# Altium schematic sheet 3_Power.schdoc.schdoc
size 309 x 223 mm; Symbol: Sheet-Symbol_A4; Device: Sheet-Symbol_A4; Company: EasyEDA.com; Drawed: EasyEDA Pro; Reviewed: EasyEDA Pro; Version: V0.1; Page Size: A4; @Project Name: AutoPilot; @Page Count: 2; @Update Date: 2023-12-01; @Create Date: 2023-10-27; @Schematic Name: Schematic1; Part Number: JLCPCB-002; @Page No: 1; @Page Name: Power
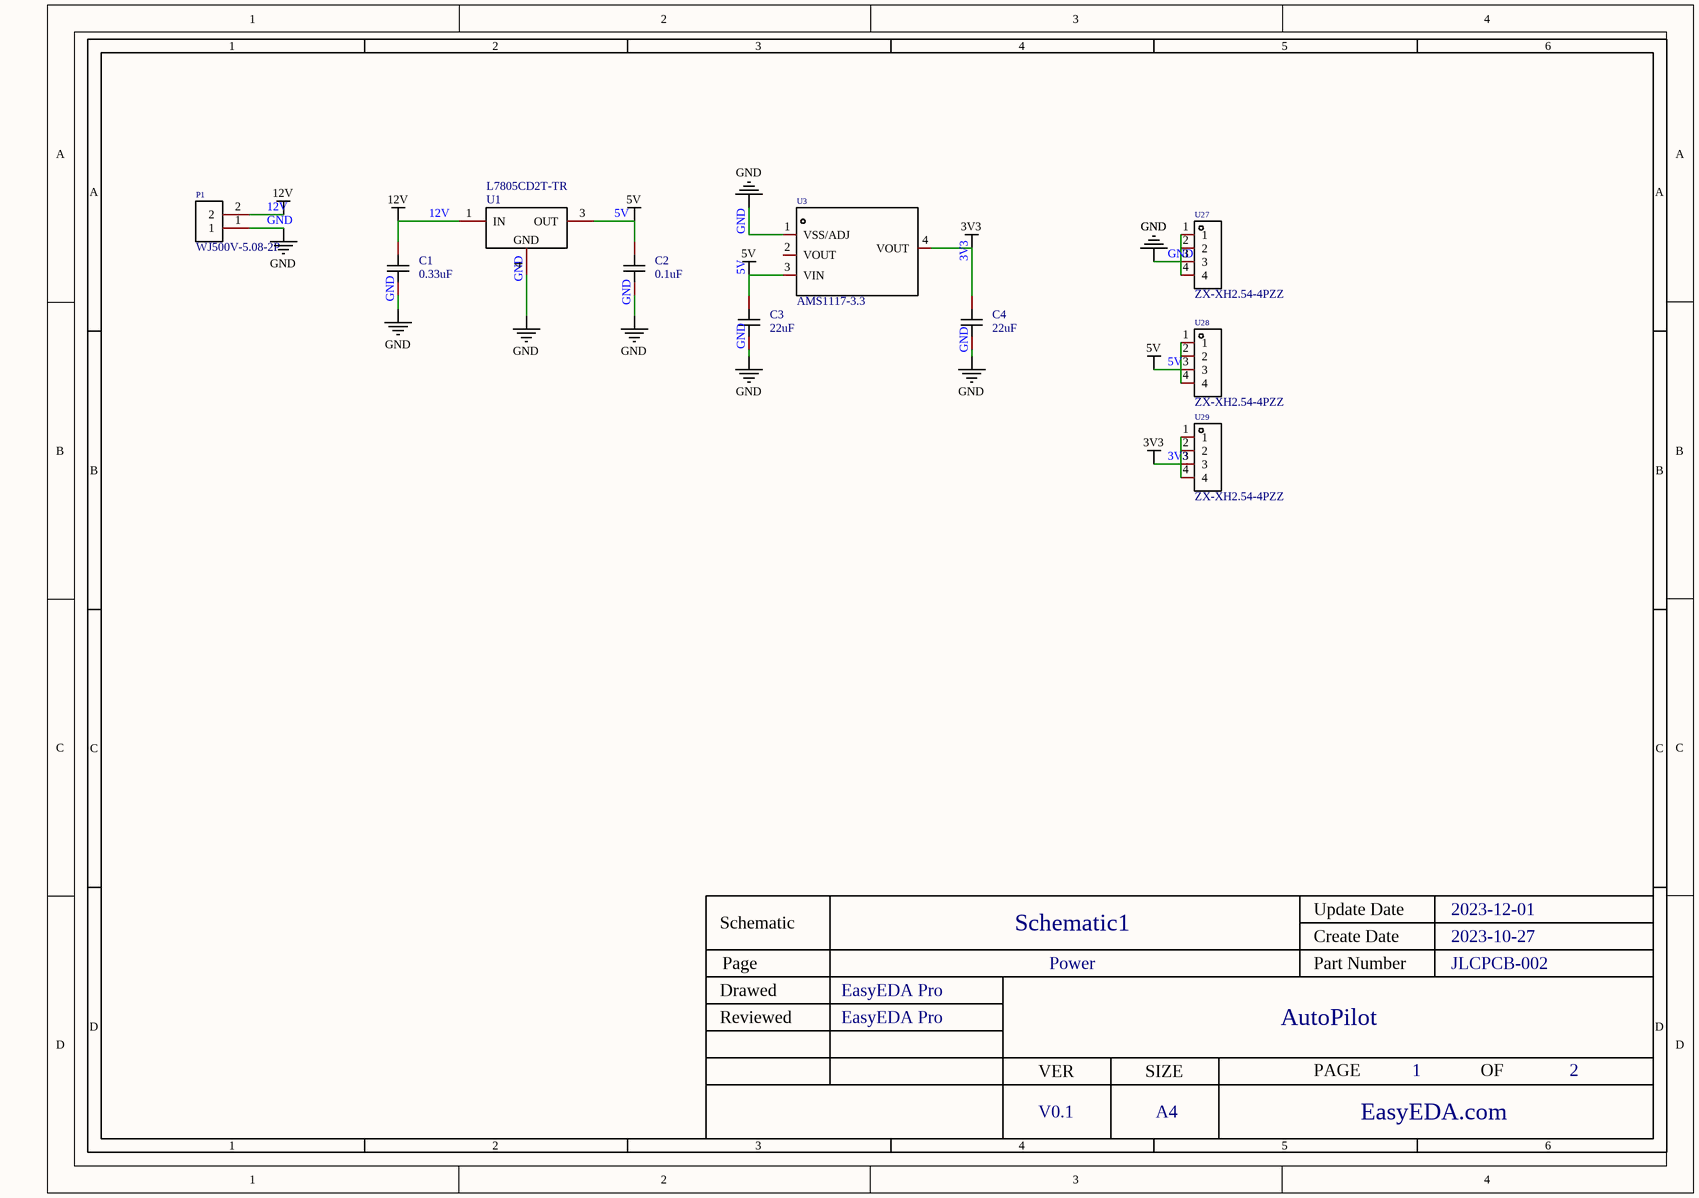
[diagram p0: 3_Power.schdoc.schdoc]

## Parts
C1  0.33uF  [C0603]
C2  0.1uF  [C0603]
C3  22uF  [C0603]
C4  22uF  [C0603]
P1  WJ500V-5.08-2P  [CONN-TH_2P-P5.00_WJ500V-5.08-2P]
U1  L7805CD2T-TR  [TO-263-2_L10.0-W9.1-P5.08-LS15.2-TL]
U3  AMS1117-3.3  [SOT-223-3_L6.4-W3.5-P2.30-LS7.0-BR]
U27  ZX-XH2.54-4PZZ  [CONN-TH_4P-P2.50_4PIN]
U28  ZX-XH2.54-4PZZ  [CONN-TH_4P-P2.50_4PIN]
U29  ZX-XH2.54-4PZZ  [CONN-TH_4P-P2.50_4PIN]

## Nets
3V3: C4.1 U3.4(VOUT) U29.1 U29.2 U29.3 U29.4
5V: C2.1 C3.1 U1.3(OUT) U3.3(VIN) U28.1 U28.2 U28.3 U28.4
12V: C1.1 P1.2 U1.1(IN)
GND: C1.2 C2.2 C3.2 C4.2 P1.1 U1.4(GND) U3.1(VSS/ADJ) U27.1 U27.2 U27.3 U27.4

Not connected (* = marked no-connect by the designer): U3 2(VOUT)

## Notes on the sheet
- 1
- 2
- 3
- 4
- 5
- 6
- A
- B
- C
- Schematic
- Schematic1
- Create Date
- Update Date
- 2023-12-01
- 2023-10-27
- Reviewed
- Drawed
- Page
- EasyEDA Pro
- Power
- Part Number
- AutoPilot
- JLCPCB-002
- D
- VER
- SIZE
- PAGE
- OF
- V0.1
- A4
- EasyEDA.com

## Library data of the parts
C1-C4 = CAP_0603: Symbol: CAP; Convert to PCB: yes; Device: CAP_0603; Add into BOM: yes; Supplier Footprint: 0603
  C1: Name: 0.33uF; Value: 0.33uF
  C2: Name: 0.1uF; Value: 0.1uF
  C3 C4: Name: 22uF; Value: 22uF
P1 = WJ500V-5.08-2P: Pitch:5.08mm Structure:1x2P Number of Rows:1 Number of PINs Per Row:2 Mounting Style:Straight Current Rating (Max):18A Voltage Rating (Max):250V Wire Gauge - AWG:14~30 Wire Gauge - AWG:14~30 Wire Gauge - mm2:2.5 Wire Gauge - mm2:2.5 Operating Temperature; Manufacturer: KANGNEX(康奈克斯电气); Symbol: WJ500V-5.08-2P-14-00A; Add into BOM: yes; Pitch: 5.08mm; Structure: 1x2P; Number of PINs Per Row: 2; Current Rating (Max): 18A; Voltage Rating (Max): 250V; Wire Gauge - AWG: 14~30; Wire Gauge - mm2: 2.5; Name: WJ500V-5.08-2P; Device: WJ500V-5.08-2P; LCSC Part Name: 5.08mm 1x2P 排数:1 每排P数:2 直插 可拼接; Supplier Part: C8465; Manufacturer Part: WJ500V-5.08-2P; Supplier Footprint: 插件,P=5.08mm; JLCPCB Part Class: Extended Part; Datasheet: https://atta.szlcsc.com/upload/public/pdf/source/20191225/C8465_02D34CE5B5B4A53DF5891601D97FA9F4.pdf; Supplier: LCSC; Convert to PCB: yes; Number of Rows: 1; Mounting Style: Straight; Operating Temperature Range: -40℃~+105℃; Color: Green; Number of Pins: 2P
U1 = L7805CD2T-TR: Output Type: Output Polarity:Positive Number of Outputs:1 Maximum Input Voltage:35V Output Voltage:5V~5V Output Voltage:5V~5V Dropout Voltage:2V@(1A) Output Current:1.5A Power Supply Rejection Ratio (PSRR):62dB@(120Hz); Manufacturer: ST(意法半导体); Add into BOM: yes; Number of Outputs: 1; Maximum Input Voltage: 35V; Output Voltage: 5V~5V; Output Current: 1.5A; Name: L7805CD2T-TR; Symbol: L7805CD2T-TR; Device: L7805CD2T-TR; LCSC Part Name: 输入35V 输出5V 1.5A; Supplier Part: C15077; Manufacturer Part: L7805CD2T-TR; Supplier Footprint: TO-263; JLCPCB Part Class: Extended Part; Datasheet: https://atta.szlcsc.com/upload/public/pdf/source/20191219/C472632_C0855675BBC73B8C8E44EE1325AAD56A.pdf; Supplier: LCSC; Convert to PCB: yes; Output Polarity: Positive; Dropout Voltage: 2V@(1A); Power Supply Rejection Ratio (PSRR): 62dB@(120Hz)
U3 = AMS1117-3.3_C5181460: Manufacturer: HX(恒佳兴); Add into BOM: yes; Name: AMS1117-3.3; Symbol: AMS1117-3.3_C5181460; Device: AMS1117-3.3_C5181460; LCSC Part Name: AMS1117-3.3; Supplier Part: C5181460; Manufacturer Part: AMS1117-3.3; Supplier Footprint: SOT-223; JLCPCB Part Class: Extended Part; Datasheet: https://atta.szlcsc.com/upload/public/pdf/source/20221124/A0FC4A7547BAED3AF8F477D5DCC568F8.pdf; Supplier: LCSC; Convert to PCB: yes
U27-U29 = ZX-XH2.54-4PZZ: Reference Series:XH Pitch:2.54mm Pins Structure:1x4P Number of Rows:1 Number of PINs Per Row:4 Row Spacing:- Gender:公型插针 Mounting Style:Straight Current Rating (Max):3A Contact Material:Brass Contact Plating:Tin Operating Temperature Range:-25℃~+85℃ Opera; Manufacturer: Megastar(兆星); Add into BOM: yes; Reference Series: XH; Pitch: 2.54mm; Pins Structure: 1x4P; Number of PINs Per Row: 4; Gender: 公型插针; Current Rating (Max): 3A; Welding Temperature (Max): 260℃; Name: ZX-XH2.54-4PZZ; Symbol: ZX-XH2.54-4PZZ; Device: ZX-XH2.54-4PZZ; LCSC Part Name: 系列:XH 间距:2.54mm 1x4P 直插; Supplier Part: C7429634; Manufacturer Part: ZX-XH2.54-4PZZ; Supplier Footprint: 插件,P=2.54mm; JLCPCB Part Class: Extended Part; Datasheet: https://atta.szlcsc.com/upload/public/pdf/source/20230619/B529A2163E0159A644AB3383D208FB03.pdf; Supplier: LCSC; Convert to PCB: yes; Number of Rows: 1; Row Spacing: -; Mounting Style: Straight; Contact Material: Brass; Contact Plating: Tin; Operating Temperature Range: -25℃~+85℃